# Altium project EIT_Phase1_v1.0.PrjPcb
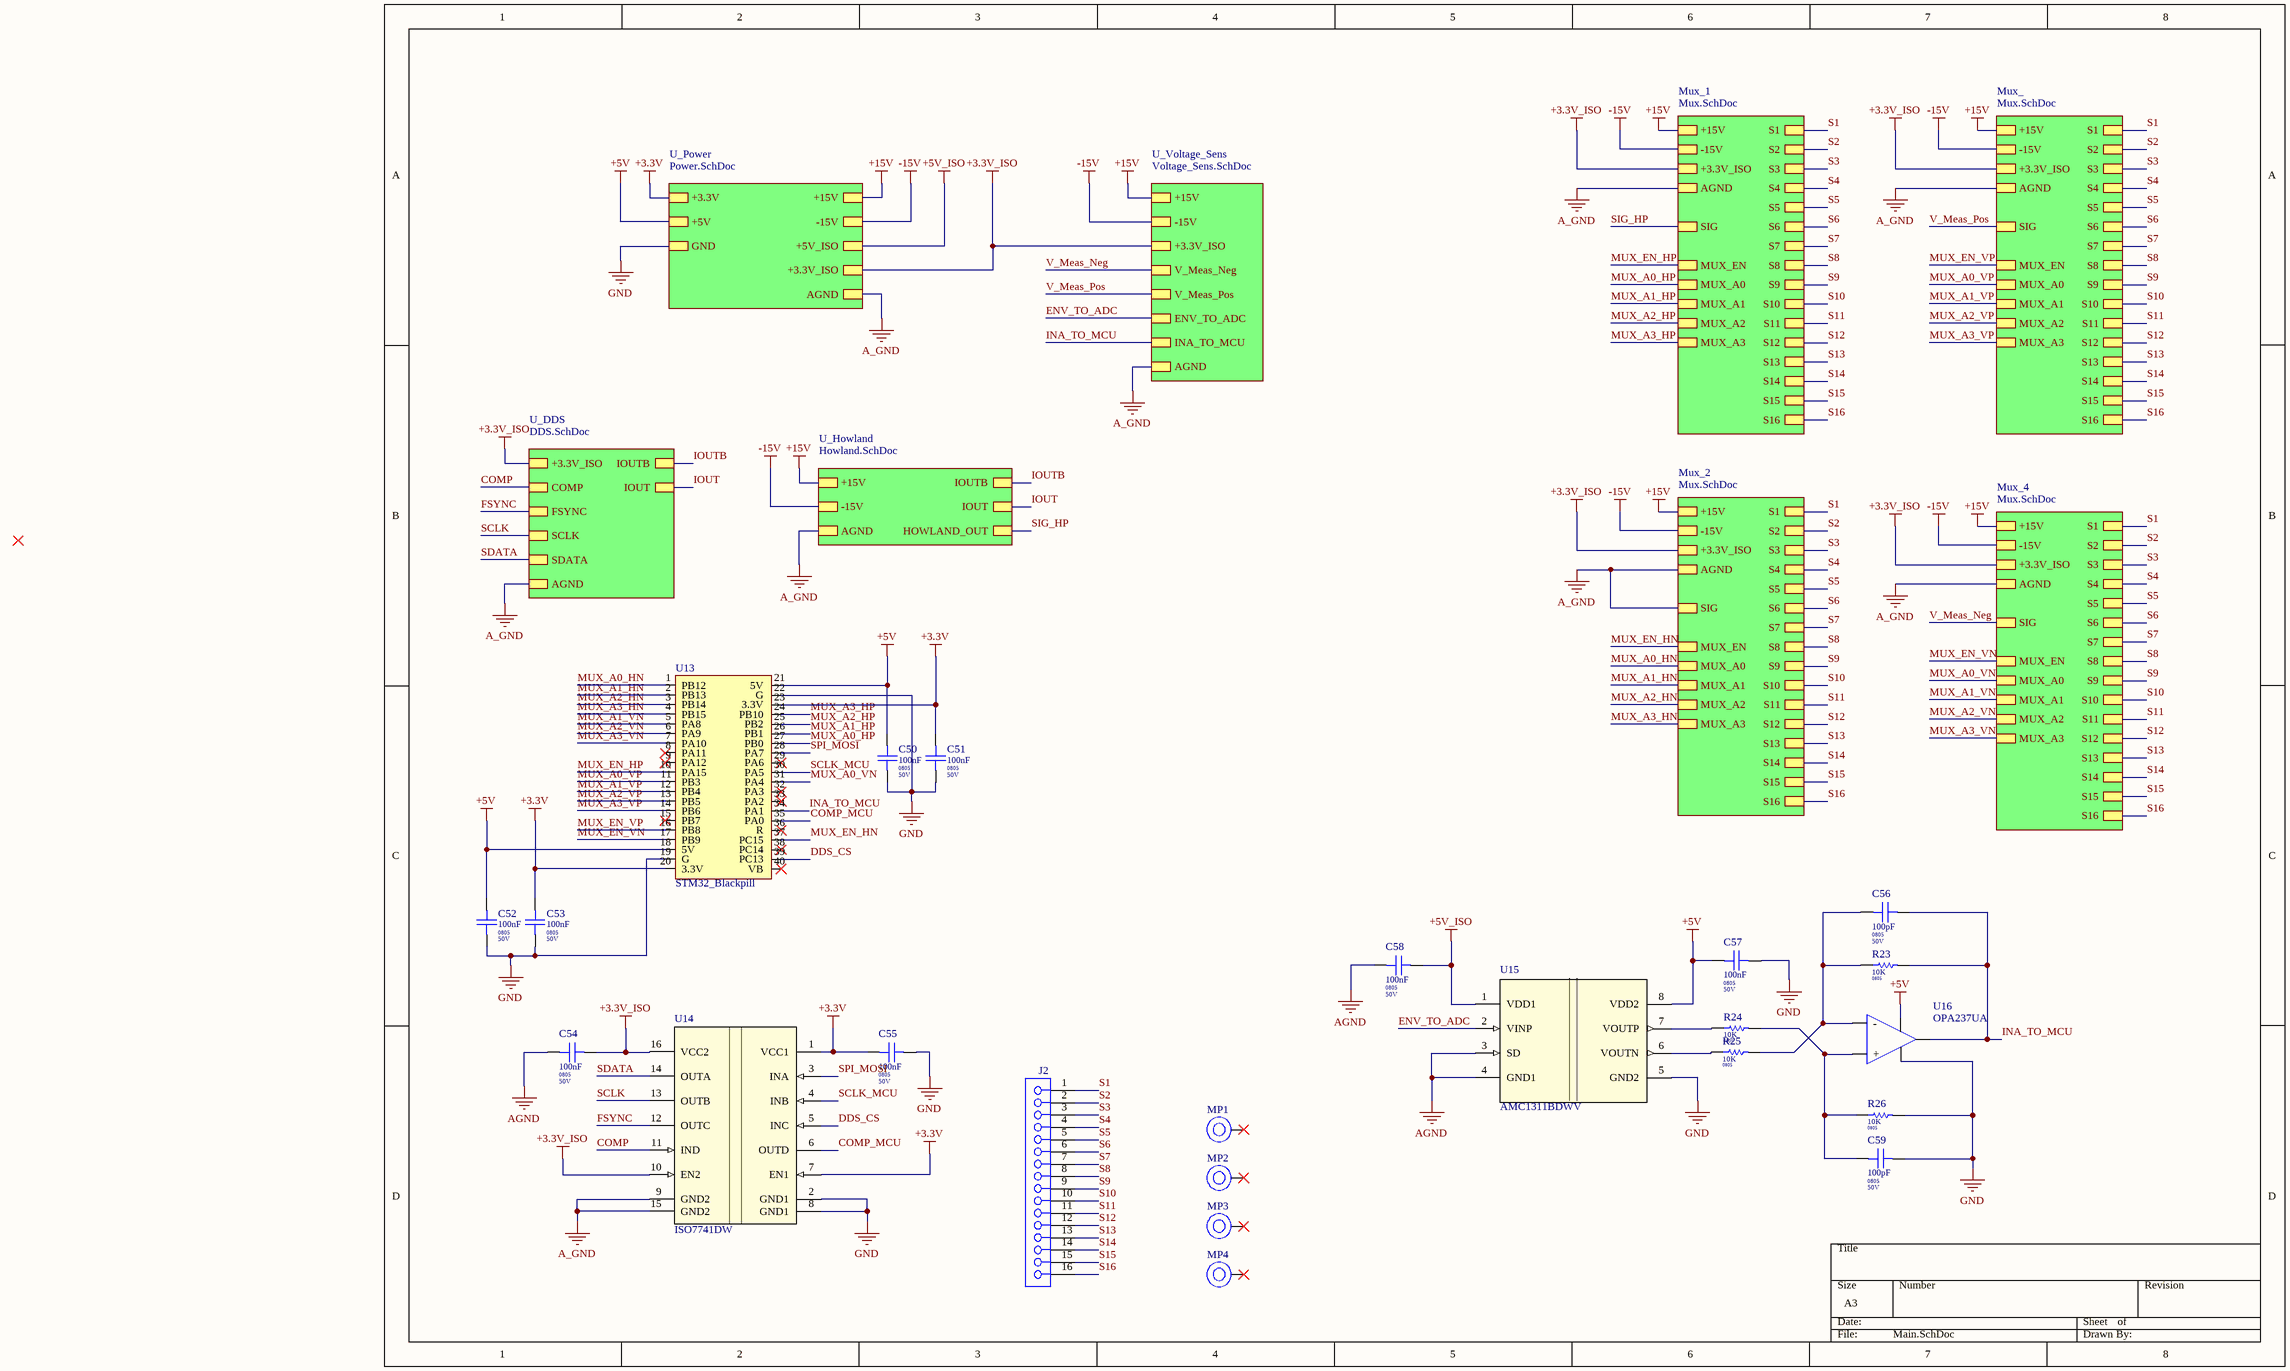
[diagram p0: Main.SchDoc]
6 sheets, 136 parts. Net scope: strictly hierarchical (ports join the sheet entries above them; power ports are local).
Board file: PCB3.PcbDoc
Sheets:
  Main.SchDoc
    U_DDS = DDS.SchDoc
    U_Howland = Howland.SchDoc
    U_Power = Power.SchDoc
    U_Voltage_Sens = Voltage_Sens.SchDoc
    Mux_1 = Mux.SchDoc
    Mux_2 = Mux.SchDoc
    Mux_ = Mux.SchDoc
    Mux_4 = Mux.SchDoc

## Sheet Main.SchDoc
size A3; SheetNumber: 1; SheetTotal: 6

### Parts
C50  Package / Case: 0805  Voltage: 50V  [CAPC 0805]  (hidden comment: 100nF)
C51  Package / Case: 0805  Voltage: 50V  [CAPC 0805]  (hidden comment: 100nF)
C52  Package / Case: 0805  Voltage: 50V  [CAPC 0805]  (hidden comment: 100nF)
C53  Package / Case: 0805  Voltage: 50V  [CAPC 0805]  (hidden comment: 100nF)
C54  Package / Case: 0805  Voltage: 50V  [CAPC 0805]  (hidden comment: 100nF)
C55  Package / Case: 0805  Voltage: 50V  [CAPC 0805]  (hidden comment: 100nF)
C56  Package / Case: 0805  Voltage: 50V  [CAPC 0805]  (hidden comment: 100pF)
C57  Package / Case: 0805  Voltage: 50V  [CAPC 0805]  (hidden comment: 100nF)
C58  Package / Case: 0805  Voltage: 50V  [CAPC 0805]  (hidden comment: 100nF)
C59  Package / Case: 0805  Voltage: 50V  [CAPC 0805]  (hidden comment: 100pF)
J2  61301611821  [61301611821]  (value not drawn)
MP1  M3 x 15mm  [78614150360]  (value not drawn)
MP2  M3 x 15mm  [78614150360]  (value not drawn)
MP3  M3 x 15mm  [78614150360]  (value not drawn)
MP4  M3 x 15mm  [78614150360]  (value not drawn)
R23  Package / Case: 0805  [RESC 0805]  (hidden comment: 10K)
R24  Package / Case: 0805  [RESC 0805]  (hidden comment: 10K)
R25  Package / Case: 0805  [RESC 0805]  (hidden comment: 10K)
R26  Package / Case: 0805  [RESC 0805]  (hidden comment: 10K)
U13  STM32_Blackpill  [STM32_Blackpıll]
U14  ISO7741DW  [DW0016B_M]
U15  AMC1311BDWV  [DWV0008A]
U16  OPA237UA  [SOIC127P599X175-8N]

### Sub-sheets
Mux_ = Mux.SchDoc: +15V, -15V, AGND, +3.3V_ISO, S16, S15, S14, S13, S12, S11, S10, S9, S8, S7, S6, S5, S4, S3, S2, S1, SIG, MUX_EN, MUX_A0, MUX_A1, MUX_A2, MUX_A3
Mux_1 = Mux.SchDoc: +15V, -15V, AGND, +3.3V_ISO, S16, S15, S14, S13, S12, S11, S10, S9, S8, S7, S6, S5, S4, S3, S2, S1, SIG, MUX_EN, MUX_A0, MUX_A1, MUX_A2, MUX_A3
Mux_2 = Mux.SchDoc: +15V, -15V, AGND, +3.3V_ISO, S16, S15, S14, S13, S12, S11, S10, S9, S8, S7, S6, S5, S4, S3, S2, S1, SIG, MUX_EN, MUX_A0, MUX_A1, MUX_A2, MUX_A3
Mux_4 = Mux.SchDoc: +15V, -15V, AGND, +3.3V_ISO, S16, S15, S14, S13, S12, S11, S10, S9, S8, S7, S6, S5, S4, S3, S2, S1, SIG, MUX_EN, MUX_A0, MUX_A1, MUX_A2, MUX_A3
U_DDS = DDS.SchDoc: +3.3V_ISO, AGND, IOUTB, IOUT, COMP, FSYNC, SCLK, SDATA
U_Howland = Howland.SchDoc: +15V, -15V, AGND, IOUTB, IOUT, HOWLAND_OUT
U_Power = Power.SchDoc: +3.3V, +15V, -15V, GND, AGND, +5V, +3.3V_ISO, +5V_ISO
U_Voltage_Sens = Voltage_Sens.SchDoc: +15V, -15V, AGND, +3.3V_ISO, V_Meas_Neg, V_Meas_Pos, ENV_TO_ADC, INA_TO_MCU

### Nets
+3.3V: C51.2 C53.2 C55.2 U13.20(3.3V) U13.23(3.3V) U14.1(VCC1) U14.7(EN1) ; sheet U_Power/+3.3V
+3.3V_ISO: C54.1 U14.10(EN2) U14.16(VCC2) ; sheet U_DDS/+3.3V_ISO, sheet U_Power/+3.3V_ISO, sheet U_Voltage_Sens/+3.3V_ISO, sheet Mux_1/+3.3V_ISO, sheet Mux_2/+3.3V_ISO, sheet Mux_/+3.3V_ISO, sheet Mux_4/+3.3V_ISO
+5V: C50.2 C52.2 C57.2 U13.18(5V) U13.21(5V) U15.8(VDD2) U16.7(V+) ; sheet U_Power/+5V
+5V_ISO: C58.1 U15.1(VDD1) ; sheet U_Power/+5V_ISO
+15V: sheet U_Howland/+15V, sheet U_Power/+15V, sheet U_Voltage_Sens/+15V, sheet Mux_1/+15V, sheet Mux_2/+15V, sheet Mux_/+15V, sheet Mux_4/+15V
-15V: sheet U_Howland/-15V, sheet U_Power/-15V, sheet U_Voltage_Sens/-15V, sheet Mux_1/-15V, sheet Mux_2/-15V, sheet Mux_/-15V, sheet Mux_4/-15V
A_GND: U14.9(GND2) U14.15(GND2) ; sheet U_DDS/AGND, sheet U_Howland/AGND, sheet U_Power/AGND, sheet U_Voltage_Sens/AGND, sheet Mux_1/AGND, sheet Mux_2/AGND, sheet Mux_2/SIG, sheet Mux_/AGND, sheet Mux_4/AGND  [project net SIG]
AGND: C54.2 C58.2 U15.3(SD) U15.4(GND1)
GND: C50.1 C51.1 C52.1 C53.1 C55.1 C57.1 C59.2 R26.1 U13.19(G) U13.22(G) U14.2(GND1) U14.8(GND1) U15.5(GND2) U16.4(V-) ; sheet U_Power/GND
COMP: U14.11(IND) ; sheet U_DDS/COMP
COMP_MCU: U13.35(PA0) U14.6(OUTD)
DDS_CS: U13.39(PC13) U14.5(INC)
ENV_TO_ADC: U15.2(VINP) ; sheet U_Voltage_Sens/ENV_TO_ADC
FSYNC: U14.12(OUTC) ; sheet U_DDS/FSYNC
INA_TO_MCU: C56.2 R23.1 U13.34(PA1) U16.6(Vout) ; sheet U_Voltage_Sens/INA_TO_MCU
IOUT: sheet U_DDS/IOUT, sheet U_Howland/IOUT
IOUTB: sheet U_DDS/IOUTB, sheet U_Howland/IOUTB
MUX_A0_HN: U13.1(PB12) ; sheet Mux_2/MUX_A0
MUX_A0_HP: U13.27(PB0) ; sheet Mux_1/MUX_A0
MUX_A0_VN: U13.31(PA4) ; sheet Mux_4/MUX_A0
MUX_A0_VP: U13.11(PB3) ; sheet Mux_/MUX_A0
MUX_A1_HN: U13.2(PB13) ; sheet Mux_2/MUX_A1
MUX_A1_HP: U13.26(PB1) ; sheet Mux_1/MUX_A1
MUX_A1_VN: U13.5(PA8) ; sheet Mux_4/MUX_A1
MUX_A1_VP: U13.12(PB4) ; sheet Mux_/MUX_A1
MUX_A2_HN: U13.3(PB14) ; sheet Mux_2/MUX_A2
MUX_A2_HP: U13.25(PB2) ; sheet Mux_1/MUX_A2
MUX_A2_VN: U13.6(PA9) ; sheet Mux_4/MUX_A2
MUX_A2_VP: U13.13(PB5) ; sheet Mux_/MUX_A2
MUX_A3_HN: U13.4(PB15) ; sheet Mux_2/MUX_A3
MUX_A3_HP: U13.24(PB10) ; sheet Mux_1/MUX_A3
MUX_A3_VN: U13.7(PA10) ; sheet Mux_4/MUX_A3
MUX_A3_VP: U13.14(PB6) ; sheet Mux_/MUX_A3
MUX_EN_HN: U13.37(PC15) ; sheet Mux_2/MUX_EN
MUX_EN_HP: U13.10(PA15) ; sheet Mux_1/MUX_EN
MUX_EN_VN: U13.17(PB9) ; sheet Mux_4/MUX_EN
MUX_EN_VP: U13.16(PB8) ; sheet Mux_/MUX_EN
S1: J2.1 ; sheet Mux_1/S1, sheet Mux_2/S1, sheet Mux_/S1, sheet Mux_4/S1
S2: J2.2 ; sheet Mux_1/S2, sheet Mux_2/S2, sheet Mux_/S2, sheet Mux_4/S2
S3: J2.3 ; sheet Mux_1/S3, sheet Mux_2/S3, sheet Mux_/S3, sheet Mux_4/S3
S4: J2.4 ; sheet Mux_1/S4, sheet Mux_2/S4, sheet Mux_/S4, sheet Mux_4/S4
S5: J2.5 ; sheet Mux_1/S5, sheet Mux_2/S5, sheet Mux_/S5, sheet Mux_4/S5
S6: J2.6 ; sheet Mux_1/S6, sheet Mux_2/S6, sheet Mux_/S6, sheet Mux_4/S6
S7: J2.7 ; sheet Mux_1/S7, sheet Mux_2/S7, sheet Mux_/S7, sheet Mux_4/S7
S8: J2.8 ; sheet Mux_1/S8, sheet Mux_2/S8, sheet Mux_/S8, sheet Mux_4/S8
S9: J2.9 ; sheet Mux_1/S9, sheet Mux_2/S9, sheet Mux_/S9, sheet Mux_4/S9
S10: J2.10 ; sheet Mux_1/S10, sheet Mux_2/S10, sheet Mux_/S10, sheet Mux_4/S10
S11: J2.11 ; sheet Mux_1/S11, sheet Mux_2/S11, sheet Mux_/S11, sheet Mux_4/S11
S12: J2.12 ; sheet Mux_1/S12, sheet Mux_2/S12, sheet Mux_/S12, sheet Mux_4/S12
S13: J2.13 ; sheet Mux_1/S13, sheet Mux_2/S13, sheet Mux_/S13, sheet Mux_4/S13
S14: J2.14 ; sheet Mux_1/S14, sheet Mux_2/S14, sheet Mux_/S14, sheet Mux_4/S14
S15: J2.15 ; sheet Mux_1/S15, sheet Mux_2/S15, sheet Mux_/S15, sheet Mux_4/S15
S16: J2.16 ; sheet Mux_1/S16, sheet Mux_2/S16, sheet Mux_/S16, sheet Mux_4/S16
SCLK: U14.13(OUTB) ; sheet U_DDS/SCLK
SCLK_MCU: U13.30(PA5) U14.4(INB)
SDATA: U14.14(OUTA) ; sheet U_DDS/SDATA
SIG_HP: sheet U_Howland/HOWLAND_OUT, sheet Mux_1/SIG
SPI_MOSI: U13.28(PA7) U14.3(INA)
V_Meas_Neg: sheet U_Voltage_Sens/V_Meas_Neg, sheet Mux_4/SIG
V_Meas_Pos: sheet U_Voltage_Sens/V_Meas_Pos, sheet Mux_/SIG
NetC56_1: C56.1 R23.2 R25.1 U16.2(-)
NetC59_1: C59.1 R24.1 R26.2 U16.3(+)
NetR24_2: R24.2 U15.7(VOUTP)
NetR25_2: R25.2 U15.6(VOUTN)

Not connected (* = marked no-connect by the designer): MP1 1*; MP2 1*; MP3 1*; MP4 1*; U13 8(PA11)* 9(PA12)* 15(PB7)* 29(PA6)* 32(PA3)* 33(PA2)* 36(R)* 38(PC14)* 40(VB)*

### Library data of the parts
C50-C55 C57 C58 = CAPC0572: Capacitor Ceramic 100nF 50V 0805; Tolerance: %10; Value Rating: nF; Favorites: Favorite; Value: 100nF; Part Number: CAPC0572; Category: Capacitor Ceramic; Values: 100nF 50V
C56 C59 = CAPC0548: Capacitor Ceramic 100pF 50V 0805; Tolerance: %10; Value Rating: pF; Value: 100pF; Part Number: CAPC0548; Category: Capacitor Ceramic; Values: 100pF 50V
J2 = 61301611821: WR-PHD Socket Header, THT, Vertical, pitch 2.54mm, 1 Row, 16P; Manufacturer: Wurth Elektronik; Contact Resistance: 20mOhm; Rated Current: 3A; Working Voltage: 250V; Withstanding Voltage: 500V; Manufacturer Part Number: 61301611821; Category: Board-to-Board Connectors; Match Code: WR-PHD; ComponentLink1Description: Website Link; ComponentLink1URL: https://www.we-online.com/redexpert/article/61301611821?ad; ComponentLink2Description: Datasheet Link; ComponentLink2URL: https://www.we-online.com/redexpert/spec/61301611821?ad; Mount: Through Hole; Min Operating Temperature: -40°C; Max Operating Temperature: 105°C; Packaging: Tray; Gender: Socket Header; Number of Pins: 16; Number of Rows: 1; Orientation: Vertical; Lead Pitch: 2.54mm
MP1-MP4 = 78614150360: WA-SMSA SMT Spacer Studs Automotive, OD 6mm, ID 4.2mm, M3 x 15mm; Manufacturer: Wurth Elektronik; Surface: Tin; Solder Cream Thickness Min: 150um; Tightenning Torque Max: 0.5N*m; Manufacturer Part Number: 78614150360; Category: SMT Spacers; Match Code: WA-SMSA; ComponentLink1Description: Website Link; ComponentLink1URL: https://www.we-online.com/redexpert/article/78614150360?ad; ComponentLink2Description: Datasheet Link; ComponentLink2URL: https://www.we-online.com/redexpert/spec/78614150360?ad; Mount: Surface Mount; Min Operating Temperature: -55°C; Max Operating Temperature: 150°C; Packaging: Tape and Reel; Height: 15mm; Automotive: Yes; Inside Diameter: 4.2mm; Material: Steel; Outside Diameter: 6mm; Thread Size: M3
R23-R26 = R0366: 10K 0805; Part Number: R0366; Tolerance: %5; Power: 1/10W; Value: 10K; Category: Resistor; Values: 10K
U14 = ISO7741DW: Robust EMC, quad-channel, 3/1, reinforced digital isolator 16-SOIC -55 to 125; Manufacturer_Name: Texas Instruments; TYPE: TYPE; RefDes: RefDes; Copyright: Copyright (C) 2026 Ultra Librarian. All rights reserved.; Manufacturer_Part_Number: ISO7741DW
U15 = AMC1311BDWV: 2-V input, precision voltage sensing reinforced isolated amplifier 8-SOIC -55 to 125; Manufacturer_Name: Texas Instruments; TYPE: TYPE; RefDes: RefDes; Copyright: Copyright (C) 2025 Ultra Librarian. All rights reserved.; Manufacturer_Part_Number: AMC1311BDWV
U16 = OPA237UA: Single-Supply Operational Amplifiers MicroAmplifier™ Series 8-SOIC -40 to 70; Manufacturer: Texas Instruments; Bandwidth: 1.5MHz; Unity Gain Bandwidth Product: 1.4MHz; Min Supply Voltage: 2.7V; Max Supply Voltage: 36V; Nominal Supply Current: 475uA; Voltage Gain: 88dB; Common Mode Rejection Ratio: 78dB; Number of Channels: 1; Slew Rate: 0.5V/µs; Max I/O Voltage: 750uV; Input Bias Current: 40nA; Operating Supply Current: 200uA; Power Supply Rejection Ratio (PSRR): 100dB; Output Current per Channel: 8mA; Operating Supply Voltage: 5V; Dual Supply Voltage: 15V; Min Dual Supply Voltage: 1.35V; Max Dual Supply Voltage: 18V; Supplier 1: Digi-Key; Manufacturer Part Number: OPA237UA; RoHS: Yes; Category: Amplifiers - Op Amps, Buffer, Instrumentation; Stock 1: 186; Pricing 1: 1=2,06000, 10=1,85400, 25=1,74880, 100=1,49010, 250=1,39920, 500=1,22430, 1000=1,15500 (USD); Case/Package: D; Number of Pins: 8; Min Operating Temperature: -40°C; Max Operating Temperature: 70°C; Package Quantity: 75; Packaging: Rail/Tube; Number of Circuits: 1; Gain Bandwidth Product: 1.4MHz; Input Offset Voltage (Vos): 750uV; Number of Elements: 1; Number of Amplifiers: 1; Nominal Gain Bandwidth Product: 1.4MHz; Length: 4.9mm; Width: 3.91mm; Height: 1.58mm; Radiation Hardening: No; Lead Free: Lead Free; REACH SVHC: No SVHC; ComponentLink1URL: https://datasheet.ciiva.com/7684/1789011-7684483.pdf?src-supplier=Element14; ComponentLink1Description: https://datasheet.ciiva.com/7684/1789011-7684483.pdf?src-supplier=Element14; ComponentLink2URL: https://datasheet.ciiva.com/22729/1716473-22729883.pdf?src-supplier=Element14; ComponentLink2Description: https://datasheet.ciiva.com/22729/1716473-22729883.pdf?src-supplier=Element14; ComponentLink3URL: https://datasheet.ciiva.com/2973/sbos057a-2973962.pdf?src-supplier=Avnet; ComponentLink3Description: https://datasheet.ciiva.com/2973/sbos057a-2973962.pdf?src-supplier=Avnet; ComponentLink4URL: https://datasheet.ciiva.com/26243/sbos057a-26243614.pdf?src-supplier=Avnet+Europe; ComponentLink4Description: https://datasheet.ciiva.com/26243/sbos057a-26243614.pdf?src-supplier=Avnet+Europe; ComponentLink5URL: https://datasheet.ciiva.com/1803/opa2237-1803652.pdf?src-supplier=Digi-Key; ComponentLink5Description: https://datasheet.ciiva.com/1803/opa2237-1803652.pdf?src-supplier=Digi-Key; ComponentLink6URL: https://datasheet.ciiva.com/48707/001011214-da-01-en-ic-opamp-gp-1-5mhz-s-opa237ua-soic-8-tid-48707210.pdf?src-supplier=Conrad; ComponentLink6Description: https://datasheet.ciiva.com/48707/001011214-da-01-en-ic-opamp-gp-1-5mhz-s-opa237ua-soic-8-tid-48707210.pdf?src-supplier=Conrad; Supplier Part Number 1: OPA237UA-ND

## Sheet DDS.SchDoc
size A4; SheetNumber: 5; SheetTotal: 6
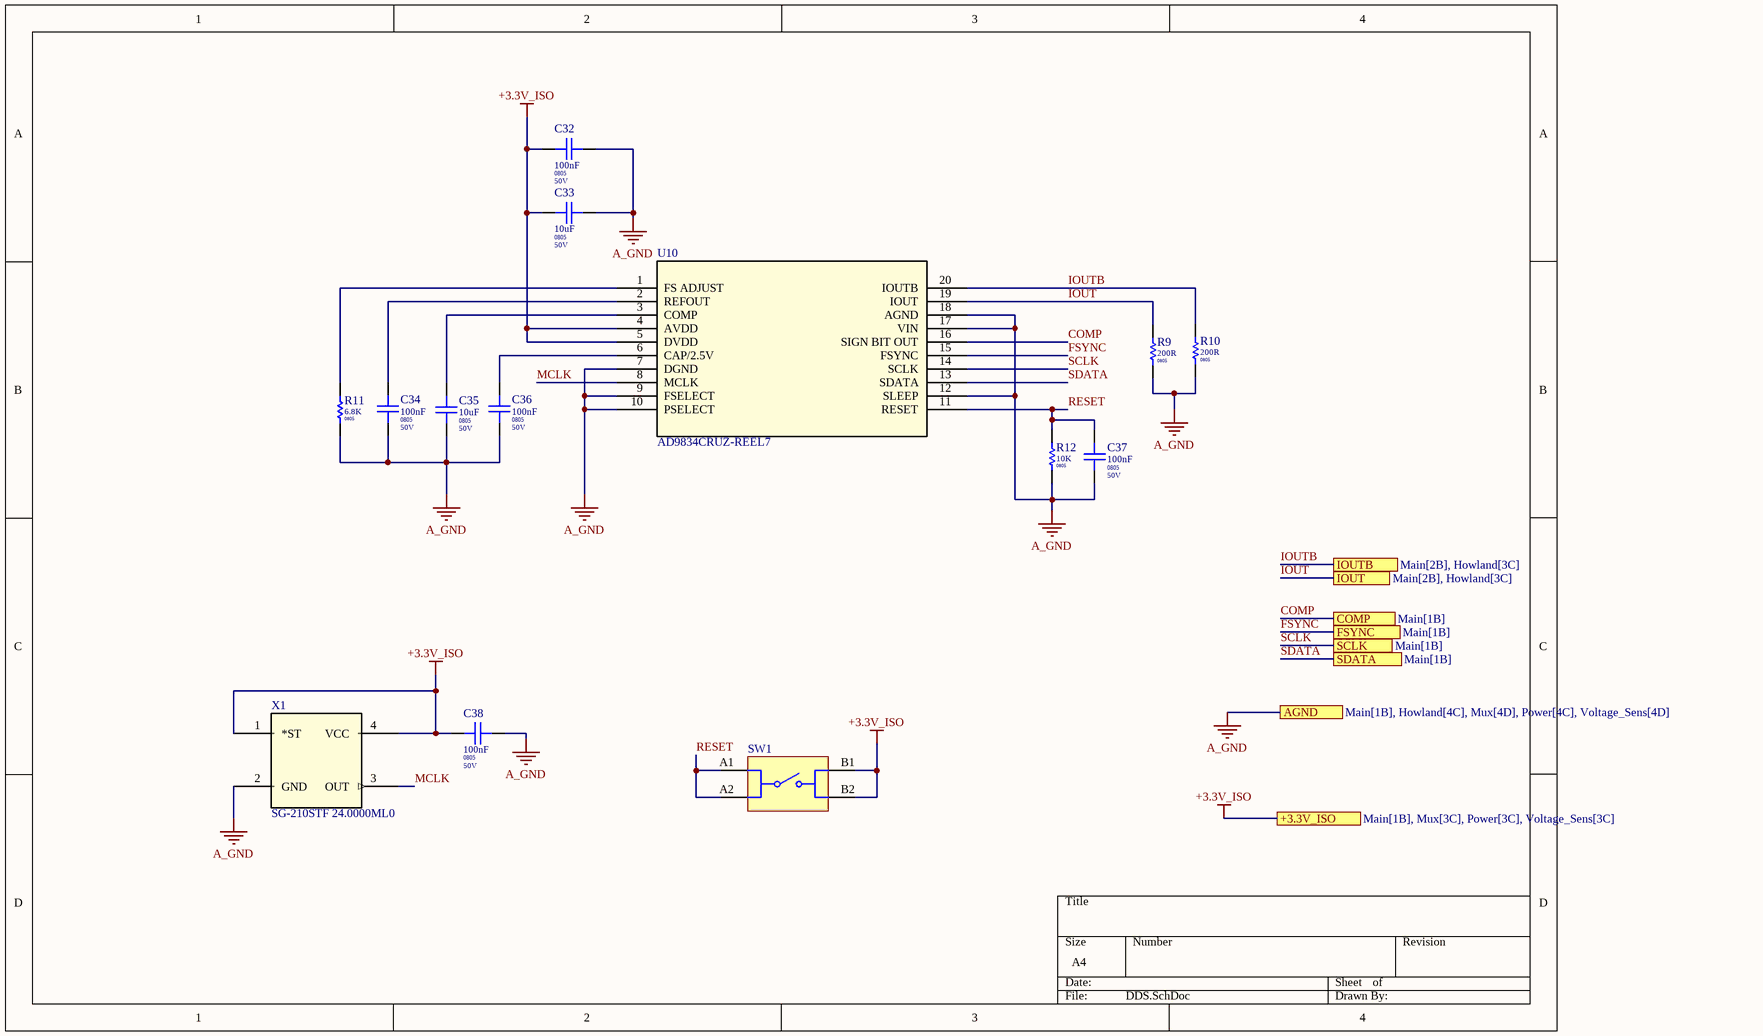
[diagram p1: DDS.SchDoc]

### Parts
C32  Package / Case: 0805  Voltage: 50V  [CAPC 0805]  (hidden comment: 100nF)
C33  Package / Case: 0805  Voltage: 50V  [CAPC 0805]  (hidden comment: 10uF)
C34  Package / Case: 0805  Voltage: 50V  [CAPC 0805]  (hidden comment: 100nF)
C35  Package / Case: 0805  Voltage: 50V  [CAPC 0805]  (hidden comment: 10uF)
C36  Package / Case: 0805  Voltage: 50V  [CAPC 0805]  (hidden comment: 100nF)
C37  Package / Case: 0805  Voltage: 50V  [CAPC 0805]  (hidden comment: 100nF)
C38  Package / Case: 0805  Voltage: 50V  [CAPC 0805]  (hidden comment: 100nF)
R9  Package / Case: 0805  [RESC 0805]  (hidden comment: 200R)
R10  Package / Case: 0805  [RESC 0805]  (hidden comment: 200R)
R11  Package / Case: 0805  [RESC 0805]  (hidden comment: 6.8K)
R12  Package / Case: 0805  [RESC 0805]  (hidden comment: 10K)
SW1  430451025836  [430451025836]  (value not drawn)
U10  AD9834CRUZ-REEL7  [RU_20_ADI-M]
X1  SG-210STF 24.0000ML0  [SG-210STF_EPS]

### Ports
+3.3V_ISO (see Main[1B], Mux[3C], Power[3C], Voltage_Sens[3C]), AGND (see Main[1B], Howland[4C], Mux[4D], Power[4C], Voltage_Sens[4D]), COMP (see Main[1B]), FSYNC (see Main[1B]), IOUT (see Main[2B], Howland[3C]), IOUTB (see Main[2B], Howland[3C]), SCLK (see Main[1B]), SDATA (see Main[1B])

### Nets
+3.3V_ISO: C32.2 C33.2 C38.2 SW1.B1 SW1.B2 U10.4(AVDD) U10.5(DVDD) X1.1(*ST) X1.4(VCC) ; port +3.3V_ISO
A_GND: C32.1 C33.1 C34.2 C35.2 C36.2 C37.2 C38.1 R9.1 R10.1 R11.1 R12.1 U10.7(DGND) U10.9(FSELECT) U10.10(PSELECT) U10.12(SLEEP) U10.17(VIN) U10.18(AGND) X1.2(GND) ; port AGND  [project net SIG]
COMP: U10.16(SIGN_BIT_OUT) ; port COMP
FSYNC: U10.15(FSYNC) ; port FSYNC
IOUT: R9.2 U10.19(IOUT) ; port IOUT
IOUTB: R10.2 U10.20(IOUTB) ; port IOUTB
MCLK: U10.8(MCLK) X1.3(OUT)
RESET: C37.1 R12.2 SW1.A1 SW1.A2 U10.11(RESET)
SCLK: U10.14(SCLK) ; port SCLK
SDATA: U10.13(SDATA) ; port SDATA
NetC34_1: C34.1 U10.2(REFOUT)
NetC35_1: C35.1 U10.3(COMP)
NetC36_1: C36.1 U10.6(CAP/2.5V)
NetR11_2: R11.2 U10.1(FS_ADJUST)

### Library data of the parts
C32 C34 C36-C38 = CAPC0572: as C50 on sheet Main; Value: 100nF; Part Number: CAPC0572; Category: Capacitor Ceramic; Values: 100nF 50V
C33 C35 = CAPC0588: Capacitor Ceramic 10uF 50V 0805; Tolerance: %10; Value Rating: uF; Value: 10uF; Part Number: CAPC0588; Category: Capacitor Ceramic; Values: 10uF 50V
R9 R10 = R0325: 200R 0805; Part Number: R0325; Tolerance: %5; Power: 1/10W; Value: 200R; Category: Resistor; Values: 200R
R11 = R0362: 6.8K 0805; Part Number: R0362; Tolerance: %5; Power: 1/10W; Value: 6.8K; Category: Resistor; Values: 6.8K
R12 = R0366: as R23 on sheet Main; Value: 10K; Category: Resistor; Values: 10K
SW1 = 430451025836: WS-TASV SMT Washable Tact Switch, 6mm x 6mm x 2.5mm, SPST-NO, 360gf, 12V, 50mA; Manufacturer: Wurth Elektronik; Washable: Yes; Manufacturer Part Number: 430451025836; Category: Tact Switch; Match Code: WS-TASV; ComponentLink1Description: Website Link; ComponentLink1URL: https://www.we-online.com/redexpert/article/430451025836?ad; ComponentLink2Description: Datasheet Link; ComponentLink2URL: https://www.we-online.com/redexpert/spec/430451025836?ad; Mount: Surface Mount; Min Operating Temperature: -40°C; Max Operating Temperature: 85°C; Packaging: Tape and Reel; Length: 6mm; Width: 6mm; Height: 2.5mm; Circuit: SPST-NO; Contact Material: Stainless Steel; Contact Plating: Silver; Operation Force: 360gf; Rated Current: 50mA; Rated Voltage (DC): 12V; Terminal Material: Brass; Terminal Plating: Silver
U10 = AD9834CRUZ-REEL7: 20 mW Power, 2.3 V to 5.5 V, 75 MHz Complete DDS; Manufacturer_Name: Analog Devices Inc; Copyright: Copyright (C) 2026 Ultra Librarian. All rights reserved.; Manufacturer_Part_Number: AD9834CRUZ-REEL7; RefDes: RefDes; Type: Type
X1 = SG-210STF 24.0000ML0: Description; Manufacturer_Name: Epson; Type: Oscillators; Copyright: Copyright (C) 2025 Ultra Librarian. All rights reserved.; Manufacturer_Part_Number: SG-210STF 24.0000ML0; RefDes: RefDes

## Sheet Howland.SchDoc
size A4; SheetNumber: 6; SheetTotal: 6
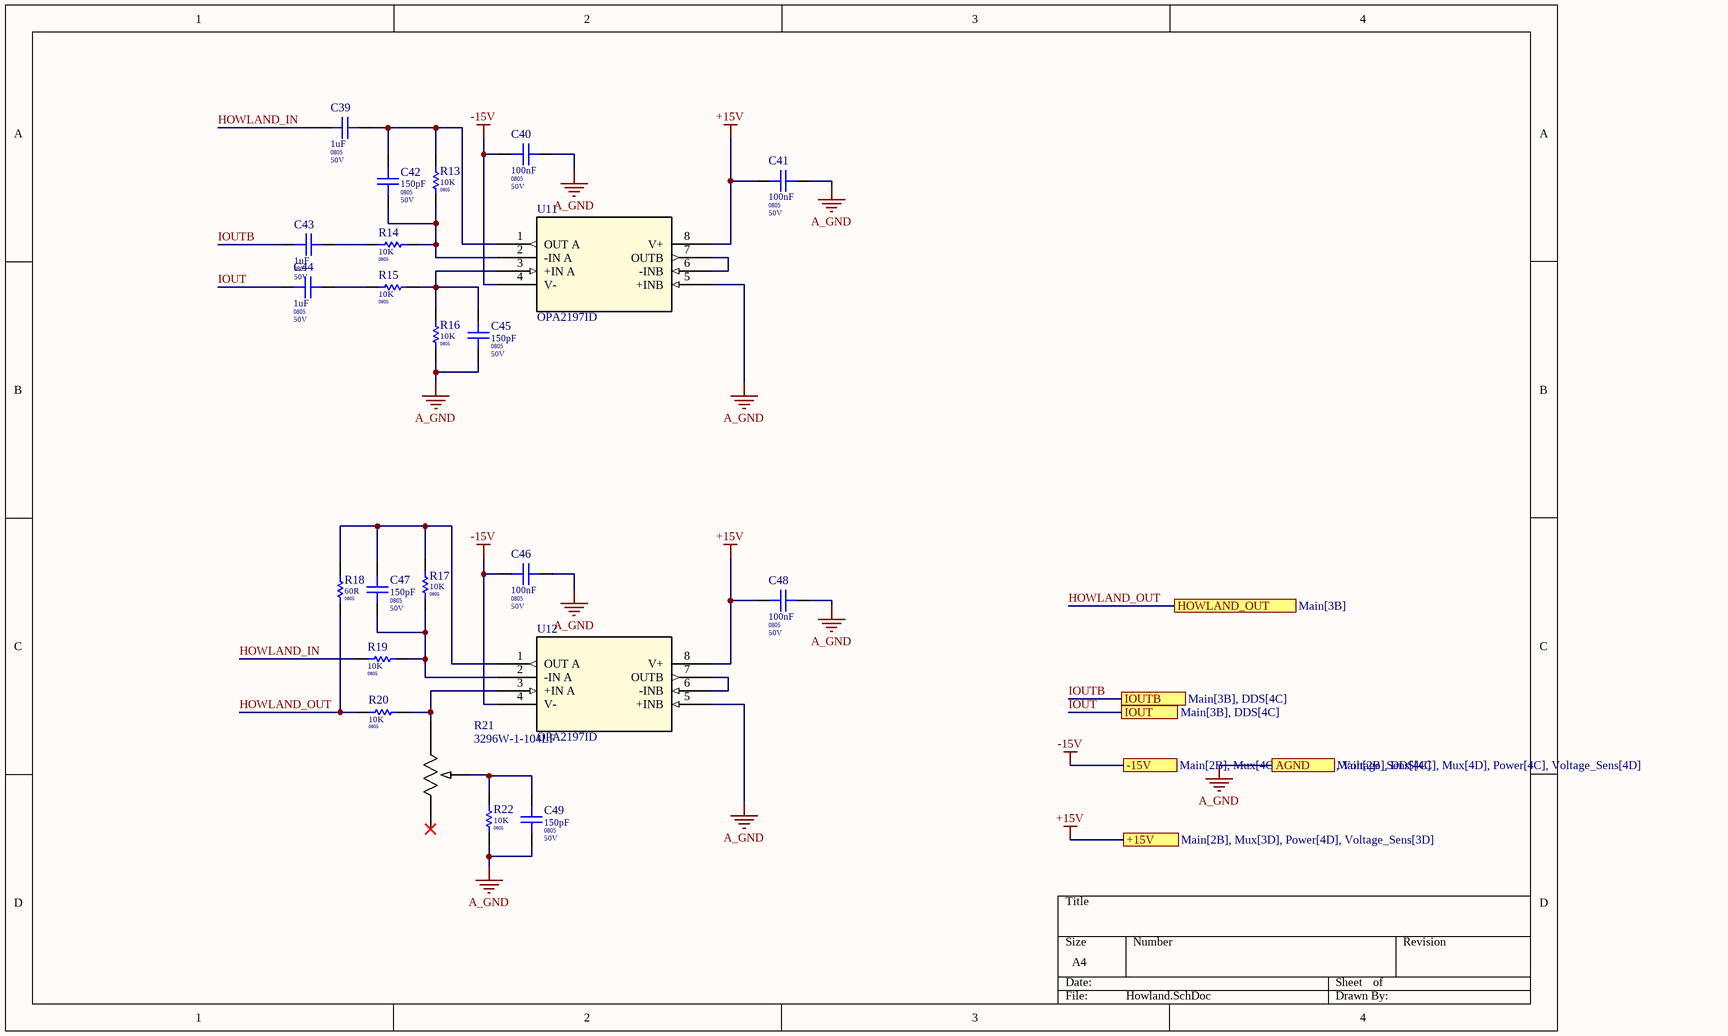
[diagram p2: Howland.SchDoc]

### Parts
C39  Package / Case: 0805  Voltage: 50V  [CAPC 0805]  (hidden comment: 1uF)
C40  Package / Case: 0805  Voltage: 50V  [CAPC 0805]  (hidden comment: 100nF)
C41  Package / Case: 0805  Voltage: 50V  [CAPC 0805]  (hidden comment: 100nF)
C42  Package / Case: 0805  Voltage: 50V  [CAPC 0805]  (hidden comment: 150pF)
C43  Package / Case: 0805  Voltage: 50V  [CAPC 0805]  (hidden comment: 1uF)
C44  Package / Case: 0805  Voltage: 50V  [CAPC 0805]  (hidden comment: 1uF)
C45  Package / Case: 0805  Voltage: 50V  [CAPC 0805]  (hidden comment: 150pF)
C46  Package / Case: 0805  Voltage: 50V  [CAPC 0805]  (hidden comment: 100nF)
C47  Package / Case: 0805  Voltage: 50V  [CAPC 0805]  (hidden comment: 150pF)
C48  Package / Case: 0805  Voltage: 50V  [CAPC 0805]  (hidden comment: 100nF)
C49  Package / Case: 0805  Voltage: 50V  [CAPC 0805]  (hidden comment: 150pF)
R13  Package / Case: 0805  [RESC 0805]  (hidden comment: 10K)
R14  Package / Case: 0805  [RESC 0805]  (hidden comment: 10K)
R15  Package / Case: 0805  [RESC 0805]  (hidden comment: 10K)
R16  Package / Case: 0805  [RESC 0805]  (hidden comment: 10K)
R17  Package / Case: 0805  [RESC 0805]  (hidden comment: 10K)
R18  Package / Case: 0805  [RESC 0805]  (hidden comment: 60R)
R19  Package / Case: 0805  [RESC 0805]  (hidden comment: 10K)
R20  Package / Case: 0805  [RESC 0805]  (hidden comment: 10K)
R21  3296W-1-104LF  [POT_3296W]
R22  Package / Case: 0805  [RESC 0805]  (hidden comment: 10K)
U11  OPA2197ID  [D8_TEX-M]
U12  OPA2197ID  [D8_TEX-M]

### Ports
+15V (see Main[2B], Mux[3D], Power[4D], Voltage_Sens[3D]), -15V (see Main[2B], Mux[4C], Power[4C], Voltage_Sens[4C]), AGND (see Main[2B], DDS[4C], Mux[4D], Power[4C], Voltage_Sens[4D]), HOWLAND_OUT (see Main[3B]), IOUT (see Main[3B], DDS[4C]), IOUTB (see Main[3B], DDS[4C])

### Nets
+15V: C41.2 C48.2 U11.8(V+) U12.8(V+) ; port +15V
-15V: C40.2 C46.2 U11.4(V-) U12.4(V-) ; port -15V
A_GND: C40.1 C41.1 C45.1 C46.1 C48.1 C49.1 R16.2 R22.2 U11.5(+INB) U12.5(+INB) ; port AGND  [project net SIG]
HOWLAND_IN: C39.1 R19.1
HOWLAND_OUT: R18.1 R20.1 ; port HOWLAND_OUT  [project net SIG_HP]
IOUT: C44.1 ; port IOUT
IOUTB: C43.1 ; port IOUTB
NetC39_2: C39.2 C42.2 R13.1 U11.1(OUT_A)
NetC42_1: C42.1 R13.2 R14.1 U11.2(-IN_A)
NetC43_2: C43.2 R14.2
NetC44_2: C44.2 R15.2
NetC45_2: C45.2 R15.1 R16.1 U11.3(+IN_A)
NetC47_1: C47.1 R17.2 R19.2 U12.2(-IN_A)
NetC47_2: C47.2 R17.1 R18.2 U12.1(OUT_A)
NetC49_2: C49.2 R21.2 R22.1
NetR20_2: R20.2 R21.1 U12.3(+IN_A)
NetU11_6: U11.6(-INB) U11.7(OUTB)
NetU12_6: U12.6(-INB) U12.7(OUTB)

Not connected (* = marked no-connect by the designer): R21 3*

### Library data of the parts
C39 C43 C44 = CAPC0580: Capacitor Ceramic 1uF 50V 0805; Tolerance: %10; Value Rating: uF; Values: 1uF 50V; Favorites: Favorite; Value: 1uF; Part Number: CAPC0580; Category: Capacitor Ceramic
C40 C41 C46 C48 = CAPC0572: as C50 on sheet Main; Value: 100nF; Part Number: CAPC0572; Category: Capacitor Ceramic; Values: 100nF 50V
C42 C45 C47 C49 = CAPC0549: Capacitor Ceramic 150pF 50V 0805; Tolerance: %10; Value Rating: pF; Value: 150pF; Part Number: CAPC0549; Category: Capacitor Ceramic; Values: 150pF 50V
R13-R17 R19 R20 R22 = R0366: as R23 on sheet Main; Value: 10K; Category: Resistor; Values: 10K
R18 = R0323: 160R 0805; Part Number: R0323; Tolerance: %5; Power: 1/10W; Value: 60R; Category: Resistor; Values: 160R
R21 = 3296W-1-104LF: Description; Manufacturer_Name: Bourns Electronics; Copyright: Copyright (C) 2025 Ultra Librarian. All rights reserved.; Manufacturer_Part_Number: 3296W-1-104LF
U11 U12 = OPA2197ID: Dual 36-V, precision, rail-to-rail input output, low offset voltage op amp 8-SOIC -40 to 125; Manufacturer_Name: Texas Instruments; Copyright: Copyright (C) 2025 Ultra Librarian. All rights reserved.; Manufacturer_Part_Number: OPA2197ID; RefDes: RefDes; Type: Type

## Sheet Power.SchDoc
size A4; SheetNumber: 2; SheetTotal: 6; SPICEModelCacheCWKBOKIO: <root> / <DocumentId>CWKBOKIO</DocumentId> / <CacheFrame Number="0"> / <Model Name="860020572003_10uf" Kind="CKT"> / <Text>******* / .subckt 860020572003_10uF 1 2 / Rser 1 3 2.05181792146 / Lser 2 4 3.250120717E-09 / C1 3 4 0.00001 / Rpar 3 4 10000000 / .ends 860020572003_10uF</Text> / </Model> / <Model Name="3816_744031100_10u" Kind="CKT"> / <Text>******* / .subckt 3816_744031100_10u 1 2 / Rp 1 2 10770 / Cp 1 2 1.28p / Rs 1 N3 0.185 / L1 N3 2 10u / .ends 3816_744031100_10u</Text> / </Model> / </CacheFrame> / </root>
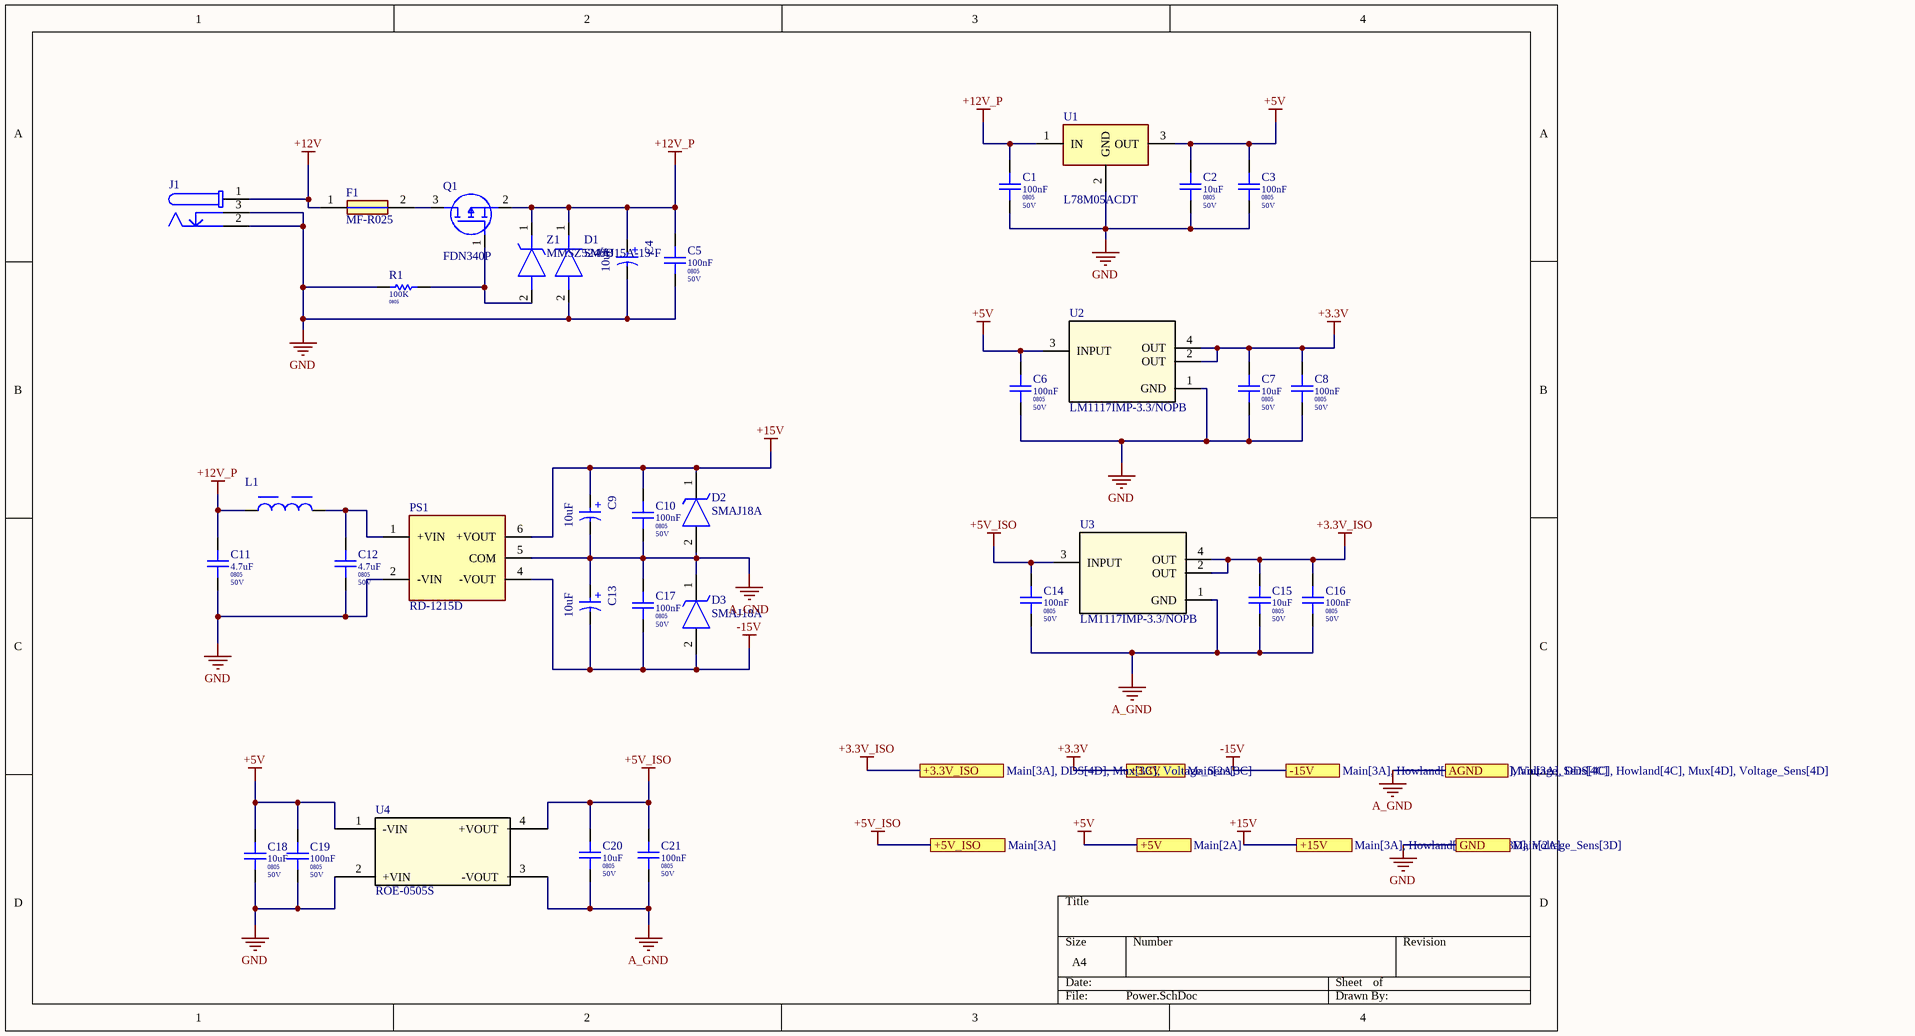
[diagram p3: Power.SchDoc]

### Parts
C1  Package / Case: 0805  Voltage: 50V  [CAPC 0805]  (hidden comment: 100nF)
C2  Package / Case: 0805  Voltage: 50V  [CAPC 0805]  (hidden comment: 10uF)
C3  Package / Case: 0805  Voltage: 50V  [CAPC 0805]  (hidden comment: 100nF)
C4  10uF  [WCAP-ATG5_D5H11]
C5  Package / Case: 0805  Voltage: 50V  [CAPC 0805]  (hidden comment: 100nF)
C6  Package / Case: 0805  Voltage: 50V  [CAPC 0805]  (hidden comment: 100nF)
C7  Package / Case: 0805  Voltage: 50V  [CAPC 0805]  (hidden comment: 10uF)
C8  Package / Case: 0805  Voltage: 50V  [CAPC 0805]  (hidden comment: 100nF)
C9  10uF  [WCAP-ATG5_D5H11]
C10  Package / Case: 0805  Voltage: 50V  [CAPC 0805]  (hidden comment: 100nF)
C11  Package / Case: 0805  Voltage: 50V  [CAPC 0805]  (hidden comment: 4.7uF)
C12  Package / Case: 0805  Voltage: 50V  [CAPC 0805]  (hidden comment: 4.7uF)
C13  10uF  [WCAP-ATG5_D5H11]
C14  Package / Case: 0805  Voltage: 50V  [CAPC 0805]  (hidden comment: 100nF)
C15  Package / Case: 0805  Voltage: 50V  [CAPC 0805]  (hidden comment: 10uF)
C16  Package / Case: 0805  Voltage: 50V  [CAPC 0805]  (hidden comment: 100nF)
C17  Package / Case: 0805  Voltage: 50V  [CAPC 0805]  (hidden comment: 100nF)
C18  Package / Case: 0805  Voltage: 50V  [CAPC 0805]  (hidden comment: 10uF)
C19  Package / Case: 0805  Voltage: 50V  [CAPC 0805]  (hidden comment: 100nF)
C20  Package / Case: 0805  Voltage: 50V  [CAPC 0805]  (hidden comment: 10uF)
C21  Package / Case: 0805  Voltage: 50V  [CAPC 0805]  (hidden comment: 100nF)
D1  SMAJ15A-13-F  [DIOM5226X240N]
D2  SMAJ18A  [DIOM5026X229N]
D3  SMAJ18A  [DIOM5026X229N]
F1  MF-R025  [MFR025]
J1  694106301002  [694106301002]  (value not drawn)
L1  10uH, 0.74A  [WE-TPC_3816]  (value not drawn)
PS1  RD-1215D  [RD1215D]
Q1  FDN340P  [SOT95P237X112-3N]
R1  Package / Case: 0805  [RESC 0805]  (hidden comment: 100K)
U1  L78M05ACDT  [L78M05ACDT]
U2  LM1117IMP-3.3/NOPB  [DCY0004A_M]
U3  LM1117IMP-3.3/NOPB  [DCY0004A_M]
U4  ROE-0505S  [ROE_RCP]
Z1  MMSZ5240B  [SOD3816X128N]

### Ports
+3.3V (see Main[2A]), +3.3V_ISO (see Main[3A], DDS[4D], Mux[3C], Voltage_Sens[3C]), +5V (see Main[2A]), +5V_ISO (see Main[3A]), +15V (see Main[3A], Howland[3D], Mux[3D], Voltage_Sens[3D]), -15V (see Main[3A], Howland[3C], Mux[4C], Voltage_Sens[4C]), AGND (see Main[3A], DDS[4C], Howland[4C], Mux[4D], Voltage_Sens[4D]), GND (see Main[2A])

### Nets
+3.3V: C7.2 C8.2 U2.2(OUT) U2.4(OUT) ; port +3.3V
+3.3V_ISO: C15.2 C16.2 U3.2(OUT) U3.4(OUT) ; port +3.3V_ISO
+5V: C2.2 C3.2 C6.2 C18.2 C19.2 U1.3(OUT) U2.3(INPUT) U4.1(-VIN) ; port +5V
+5V_ISO: C14.2 C20.2 C21.2 U3.3(INPUT) U4.4(+VOUT) ; port +5V_ISO
+12V: F1.1 J1.1
+12V_P: C1.2 C4.1(P) C5.2 C11.2 D1.1(K) L1.1 Q1.2(S) U1.1(IN) Z1.1(K)
+15V: C9.1(P) C10.2 D2.1(K) PS1.6(+VOUT) ; port +15V
-15V: C13.2(N) C17.1 D3.2(A) PS1.4(-VOUT) ; port -15V
A_GND: C9.2(N) C10.1 C13.1(P) C14.1 C15.1 C16.1 C17.2 C20.1 C21.1 D2.2(A) D3.1(K) PS1.5(COM) U3.1(GND) U4.3(-VOUT) ; port AGND  [project net SIG]
GND: C1.1 C2.1 C3.1 C4.2(N) C5.1 C6.1 C7.1 C8.1 C11.1 C12.1 C18.1 C19.1 D1.2(A) J1.2 J1.3 PS1.2(-VIN) R1.2 U1.2(GND) U2.1(GND) U4.2(+VIN) ; port GND
NetC12_2: C12.2 L1.2 PS1.1(+VIN)
NetF1_2: F1.2 Q1.3(D)
NetQ1_1: Q1.1(G) R1.1 Z1.2(A)

### Notes on the sheet
- (in symbol 860020572003) +

### Library data of the parts
C1 C3 C5 C6 C8 C10 C14 C16 C17 C19 C21 = CAPC0572: as C50 on sheet Main; Value: 100nF; Part Number: CAPC0572; Category: Capacitor Ceramic; Values: 100nF 50V
C2 C7 C15 C18 C20 = CAPC0588: as C33 on sheet DDS; Value: 10uF; Part Number: CAPC0588; Category: Capacitor Ceramic; Values: 10uF 50V
C4 C9 C13 = 860020572003: WCAP-ATG5 Aluminum Electrolytic Capacitor, Radial, THT, D5 x H11mm, 10µF, 35V; Manufacturer: Wurth Elektronik; Capacitance Tolerance: +/-20%; Dissipation Factor: 12%; Endurance: 2000h; Leakage Current: 3.5uA; Ripple Current: 46mA; Technical Reference: ATDC110100M035DSPA3B000; Manufacturer Part Number: 860020572003; Category: Aluminum Electrolytic Capacitors; Match Code: WCAP-ATG5; ComponentLink1Description: Website Link; ComponentLink1URL: https://www.we-online.com/redexpert/article/860020572003?ad; ComponentLink2Description: Datasheet Link; ComponentLink2URL: https://www.we-online.com/redexpert/spec/860020572003?ad; Mount: Through Hole; Min Operating Temperature: -40°C; Max Operating Temperature: 105°C; Packaging: Ammo Pack; Height: 11mm; Diameter: 5mm; Capacitance: 10uF; Rated Voltage (DC): 35V
C11 C12 = CAPC0584: Capacitor Ceramic 4.7uF 50V 0805; Tolerance: %10; Value Rating: uF; Value: 4.7uF; Part Number: CAPC0584; Category: Capacitor Ceramic; Values: 4.7uF 50V
D1 = SMAJ15A-13-F: Diode; Manufacturer_Name: Diodes Incorporated; Datasheet Link: https://www.diodes.com/assets/Datasheets/ds19005.pdf; Height: 2.4mm; Manufacturer_Part_Number: SMAJ15A-13-F; Mouser Part Number: 621-SMAJ15A-13-F; Mouser Price/Stock: https://www.mouser.co.uk/ProductDetail/Diodes-Incorporated/SMAJ15A-13-F?qs=sxN%252BoM2fis%252B5%252BK6%2FciupkA%3D%3D; Arrow Part Number: SMAJ15A-13-F; Arrow Price/Stock: https://www.arrow.com/en/products/smaj15a-13-f/diodes-incorporated.html?utm_currency=USD&region=europe
D2 D3 = SMAJ18A: TVS Diode (Uni-directional); Manufacturer_Name: LITTELFUSE; Datasheet Link: https://www.littelfuse.com/~/media/electronics/datasheets/tvs_diodes/littelfuse_tvs_diode_smaj_datasheet.pdf.pdf; Height: 2.29mm; Manufacturer_Part_Number: SMAJ18A; Mouser Part Number: 576-SMAJ18A; Mouser Price/Stock: https://www.mouser.co.uk/ProductDetail/Littelfuse/SMAJ18A?qs=HR2RnyOI4E7wHW1lca9u5w%3D%3D; Arrow Part Number: SMAJ18A; Arrow Price/Stock: https://www.arrow.com/en/products/smaj18a/littelfuse?utm_currency=USD&region=nac
F1 = MF-R025: Fuse; Manufacturer_Name: Bourns; Datasheet Link: https://www.mouser.ph/datasheet/2/54/mf_r-777680.pdf; Height: 7.4mm; Manufacturer_Part_Number: MF-R025; Mouser Part Number: 652-MFR025; Mouser Price/Stock: https://www.mouser.co.uk/ProductDetail/Bourns/MF-R025?qs=NmEazmuVvbXTkonguszQtA%3D%3D; Arrow Part Number: MF-R025; Arrow Price/Stock: https://www.arrow.com/en/products/mf-r025/bourns?utm_currency=USD&region=nac
J1 = 694106301002: WR-DC Power Jack, THT, Right Angled, Center Pin 2mm, 5A, 30V (DC); Manufacturer: Wurth Elektronik; Plug Outer Diameter: 5.5mm; Manufacturer Part Number: 694106301002; Category: DC Power Jack Connector; Match Code: WR-DC; ComponentLink1Description: Website Link; ComponentLink1URL: https://www.we-online.com/redexpert/article/694106301002?ad; ComponentLink2Description: Datasheet Link; ComponentLink2URL: https://www.we-online.com/redexpert/spec/694106301002?ad; Mount: Through Hole; Min Operating Temperature: -40°C; Max Operating Temperature: 85°C; Packaging: Bag; Center Pin Diameter: 2mm; Orientation: Right Angled; Rated Current: 5A; Working Voltage: 30V (DC)
L1 = 744031100: WE-TPC SMT Tiny Power Inductor, size 3816, 10uH, 0.74A, 185mOhm; Manufacturer: Wurth Elektronik; Case/Size Code: 3816; Saturation Current: 0.56A; Self Resonant Frequency: 45MHz; Manufacturer Part Number: 744031100; Category: Power Inductors; Match Code: WE-TPC; ComponentLink1Description: Website Link; ComponentLink1URL: https://www.we-online.com/redexpert/article/744031100?ad; ComponentLink2Description: Datasheet Link; ComponentLink2URL: https://www.we-online.com/redexpert/spec/744031100?ad; Mount: Surface Mount; Min Operating Temperature: -40°C; Max Operating Temperature: 125°C; Packaging: Tape and Reel; Length: 3.8mm; Width: 3.8mm; Height: 1.65mm; DC Resistance: 185mOhm; Inductance: 10uH; Rated Current: 0.74A
PS1 = RD-1215D: Power Supply; Manufacturer_Name: RECOM Power; Datasheet Link: https://www.mouser.com/datasheet/2/468/RD-958126.pdf; Height: 10.7mm; Manufacturer_Part_Number: RD-1215D; Mouser Part Number: 919-RD-1215D; Mouser Price/Stock: https://www.mouser.co.uk/ProductDetail/RECOM-Power/RD-1215D?qs=XF8hdbuHJAUeGblPqJIAfA%3D%3D
Q1 = FDN340P: MOSFET (P-Channel); Manufacturer_Name: onsemi; Datasheet Link: https://www.onsemi.com/pub/Collateral/FDN340P-D.PDF; Height: 1.12mm; Manufacturer_Part_Number: FDN340P; Mouser Part Number: 512-FDN340P; Mouser Price/Stock: https://www.mouser.co.uk/ProductDetail/onsemi-Fairchild/FDN340P?qs=AMp2PTjoga9dhzFXRaqTZw%3D%3D; Arrow Part Number: FDN340P; Arrow Price/Stock: https://www.arrow.com/en/products/fdn340p/on-semiconductor?utm_currency=USD&region=nac
R1 = R0390: 100K 0805; Part Number: R0390; Tolerance: %5; Power: 1/10W; Value: 100K; Category: Resistor; Values: 100K
U1 = L78M05ACDT: Integrated Circuit; Manufacturer_Name: STMicroelectronics; Datasheet Link: https://componentsearchengine.com/Datasheets/2/L78M05ACDT.pdf; Height: 2.4mm; Manufacturer_Part_Number: L78M05ACDT; Mouser Part Number: 511-L78M05ACDT; Mouser Price/Stock: https://www.mouser.co.uk/ProductDetail/STMicroelectronics/L78M05ACDT?qs=y2nfjSRjEj0AoPOeCXWRuA%3D%3D
U2 U3 = LM1117IMP-3.3NOPB: 800-mA 15-V linear voltage regulator 4-SOT-223 -40 to 125; Manufacturer_Name: Texas Instruments; TYPE: TYPE; RefDes: RefDes; Copyright: Copyright (C) 2025 Ultra Librarian. All rights reserved.; Manufacturer_Part_Number: LM1117IMP-3.3/NOPB
U4 = ROE-0505S: Description; Manufacturer_Name: Recom Power; Copyright: Copyright (C) 2026 Ultra Librarian. All rights reserved.; Manufacturer_Part_Number: ROE-0505S; RefDes: RefDes; Type: Type
Z1 = MMSZ5240B: Zener Diode; Manufacturer_Name: onsemi; Datasheet Link: https://eu.mouser.com/datasheet/2/308/MMSZ5226B-1301377.pdf; Height: 1.28mm; Manufacturer_Part_Number: MMSZ5240B; Mouser Part Number: 512-MMSZ5240B; Mouser Price/Stock: https://www.mouser.co.uk/ProductDetail/onsemi-Fairchild/MMSZ5240B?qs=FITO%2F%2FQgYDlKkHnZqrmSpg%3D%3D; Arrow Part Number: MMSZ5240B; Arrow Price/Stock: https://www.arrow.com/en/products/mmsz5240b/on-semiconductor

## Sheet Voltage_Sens.SchDoc
size A4; SheetNumber: 4; SheetTotal: 6
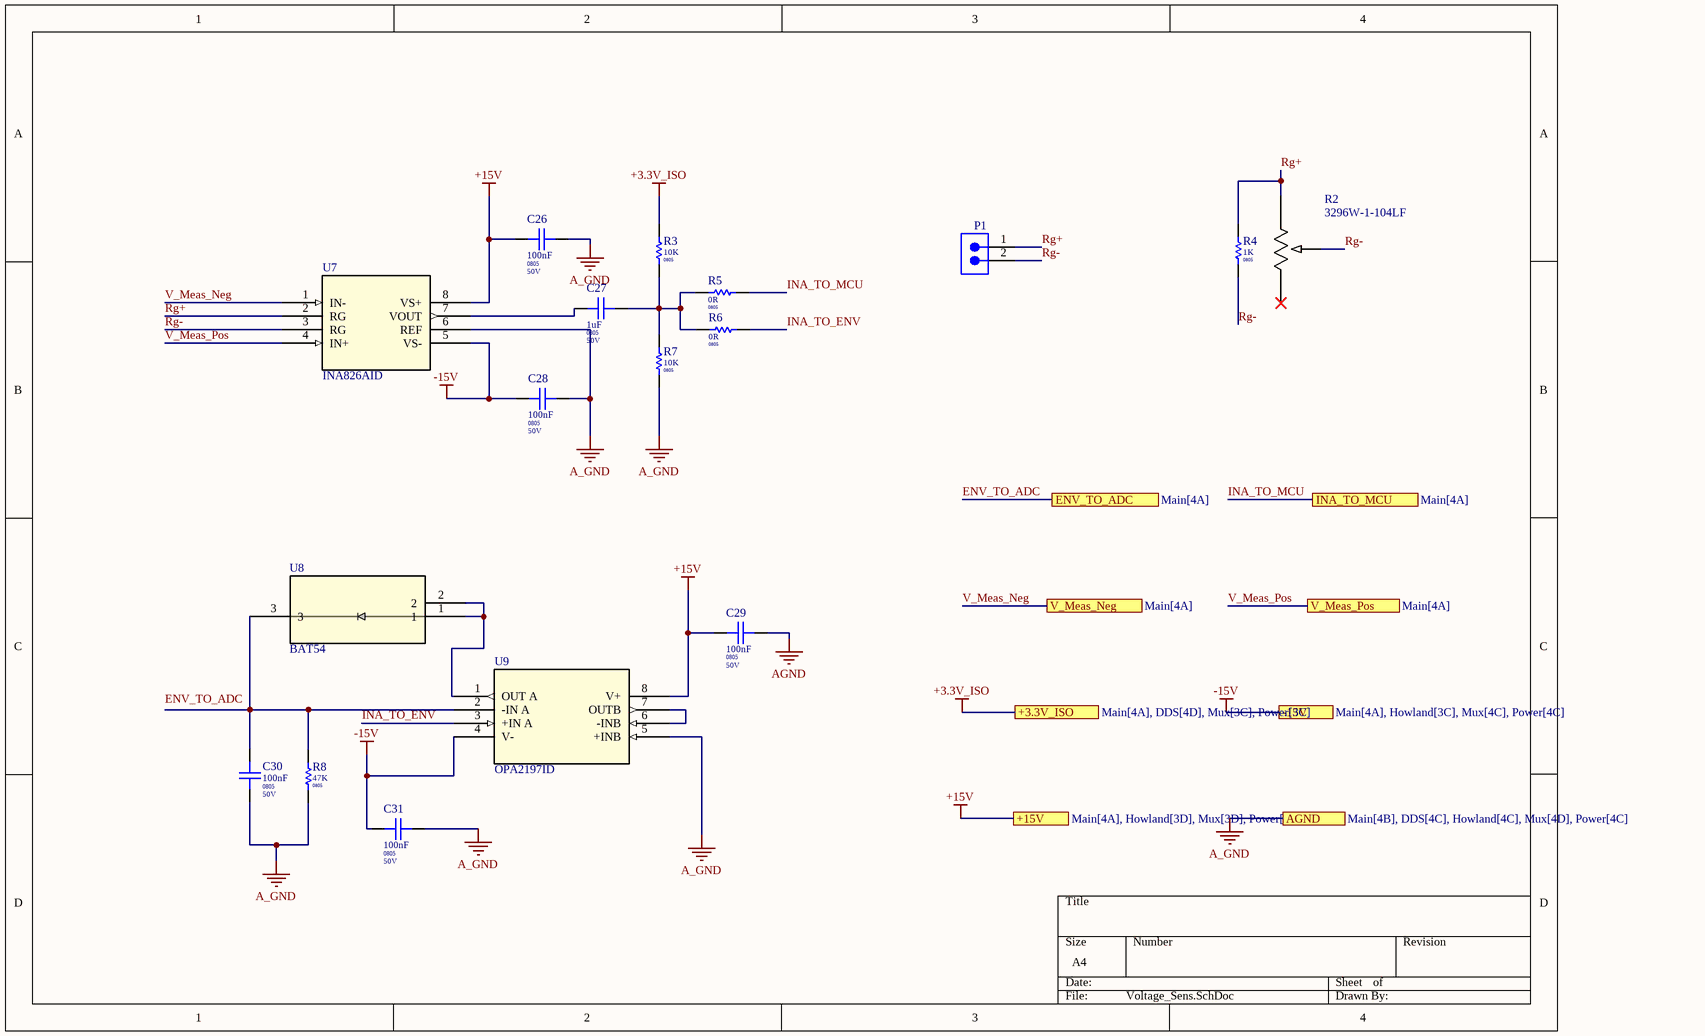
[diagram p4: Voltage_Sens.SchDoc]

### Parts
C26  Package / Case: 0805  Voltage: 50V  [CAPC 0805]  (hidden comment: 100nF)
C27  Package / Case: 0805  Voltage: 50V  [CAPC 0805]  (hidden comment: 1uF)
C28  Package / Case: 0805  Voltage: 50V  [CAPC 0805]  (hidden comment: 100nF)
C29  Package / Case: 0805  Voltage: 50V  [CAPC 0805]  (hidden comment: 100nF)
C30  Package / Case: 0805  Voltage: 50V  [CAPC 0805]  (hidden comment: 100nF)
C31  Package / Case: 0805  Voltage: 50V  [CAPC 0805]  (hidden comment: 100nF)
P1  61300211121  [61300211121]  (value not drawn)
R2  3296W-1-104LF  [POT_3296W]
R3  Package / Case: 0805  [RESC 0805]  (hidden comment: 10K)
R4  Package / Case: 0805  [RESC 0805]  (hidden comment: 1K)
R5  Package / Case: 0805  [RESC 0805]  (hidden comment: 0R)
R6  Package / Case: 0805  [RESC 0805]  (hidden comment: 0R)
R7  Package / Case: 0805  [RESC 0805]  (hidden comment: 10K)
R8  Package / Case: 0805  [RESC 0805]  (hidden comment: 47K)
U7  INA826AID  [D8-M]
U8  BAT54  [SOT-23_3L_ONS-M]
U9  OPA2197ID  [D8_TEX-M]

### Ports
+3.3V_ISO (see Main[4A], DDS[4D], Mux[3C], Power[3C]), +15V (see Main[4A], Howland[3D], Mux[3D], Power[4D]), -15V (see Main[4A], Howland[3C], Mux[4C], Power[4C]), AGND (see Main[4B], DDS[4C], Howland[4C], Mux[4D], Power[4C]), ENV_TO_ADC (see Main[4A]), INA_TO_MCU (see Main[4A]), V_Meas_Neg (see Main[4A]), V_Meas_Pos (see Main[4A])

### Nets
+3.3V_ISO: R3.2 ; port +3.3V_ISO
+15V: C26.2 C29.2 U7.8(VS+) U9.8(V+) ; port +15V
-15V: C28.2 C31.2 U7.5(VS-) U9.4(V-) ; port -15V
A_GND: C26.1 C28.1 C30.2 C31.1 R7.1 R8.1 U7.6(REF) U9.5(+INB) ; port AGND  [project net SIG]
AGND: C29.1
INA_TO_ENV: R6.2 U9.3(+IN_A)
INA_TO_MCU: R5.2 ; port INA_TO_MCU
Rg+: P1.1 R2.1 R4.2 U7.2(RG)
Rg-: P1.2 R2.2 R4.1 U7.3(RG)
V_Meas_Neg: U7.1(IN-) ; port V_Meas_Neg
V_Meas_Pos: U7.4(IN+) ; port V_Meas_Pos
NetC27_1: C27.1 U7.7(VOUT)
NetC27_2: C27.2 R3.1 R5.1 R6.1 R7.2
NetC30_1: C30.1 R8.2 U8.3 U9.2(-IN_A)
NetU8_1: U8.1 U8.2 U9.1(OUT_A)
NetU9_6: U9.6(-INB) U9.7(OUTB)

Not connected (* = marked no-connect by the designer): R2 3*

### Notes on the sheet
- Labels drawn without touching a wire or pin: ENV_TO_ADC

### Library data of the parts
C26 C28-C31 = CAPC0572: as C50 on sheet Main; Value: 100nF; Part Number: CAPC0572; Category: Capacitor Ceramic; Values: 100nF 50V
C27 = CAPC0580: as C39 on sheet Howland; Value: 1uF; Part Number: CAPC0580; Category: Capacitor Ceramic
P1 = 61300211121: WR-PHD Pin Header, THT, Vertical, pitch 2.54mm, 1 Row, 2P; Manufacturer: Wurth Elektronik; Contact Resistance: 20mOhm; Rated Current: 3A; Working Voltage: 250V; Withstanding Voltage: 500V; Manufacturer Part Number: 61300211121; Category: Board-to-Board Connectors; Match Code: WR-PHD; ComponentLink1Description: Website Link; ComponentLink1URL: https://www.we-online.com/redexpert/article/61300211121?ad; ComponentLink2Description: Datasheet Link; ComponentLink2URL: https://www.we-online.com/redexpert/spec/61300211121?ad; Mount: Through Hole; Min Operating Temperature: -40°C; Max Operating Temperature: 105°C; Packaging: Bag; Gender: Pin Header; Number of Pins: 2; Number of Rows: 1; Orientation: Vertical; Lead Pitch: 2.54mm
R2 = 3296W-1-104LF: as R21 on sheet Howland; Copyright: Copyright (C) 2025 Ultra Librarian. All rights reserved.; Manufacturer_Part_Number: 3296W-1-104LF
R3 R7 = R0366: as R23 on sheet Main; Value: 10K; Category: Resistor; Values: 10K
R4 = R0342: 1K 0805; Part Number: R0342; Tolerance: %5; Power: 1/10W; Value: 1K; Category: Resistor; Values: 1K
R5 R6 = R0294: 0R 0805; Part Number: R0294; Tolerance: %5; Power: 1/10W; Value: 0R; Category: Resistor; Values: 0R
R8 = R0382: 47K 0805; Part Number: R0382; Tolerance: %5; Power: 1/10W; Value: 47K; Category: Resistor; Values: 47K
U7 = INA826AID: Precision, 200-Î¼A Supply Current, 36-V Supply Instrumentation Amplifier 8-SOIC -40 to 125; Manufacturer_Name: Texas Instruments; Copyright: Copyright (C) 2025 Ultra Librarian. All rights reserved.; Manufacturer_Part_Number: INA826AID; RefDes: RefDes; Type: Type
U8 = BAT54: Description; Manufacturer_Name: onsemi; Copyright: Copyright (C) 2025 Ultra Librarian. All rights reserved.; Manufacturer_Part_Number: BAT54; RefDes: RefDes; Type: Type
U9 = OPA2197ID: as U11 on sheet Howland; Copyright: Copyright (C) 2025 Ultra Librarian. All rights reserved.; Manufacturer_Part_Number: OPA2197ID; RefDes: RefDes; Type: Type

## Sheet Mux.SchDoc
size A4; SheetNumber: 3; SheetTotal: 6
Used 4 times, as channels Mux_1, Mux_2, Mux_, Mux_4. Parts and nets are listed once, with the designators drawn on the sheet.
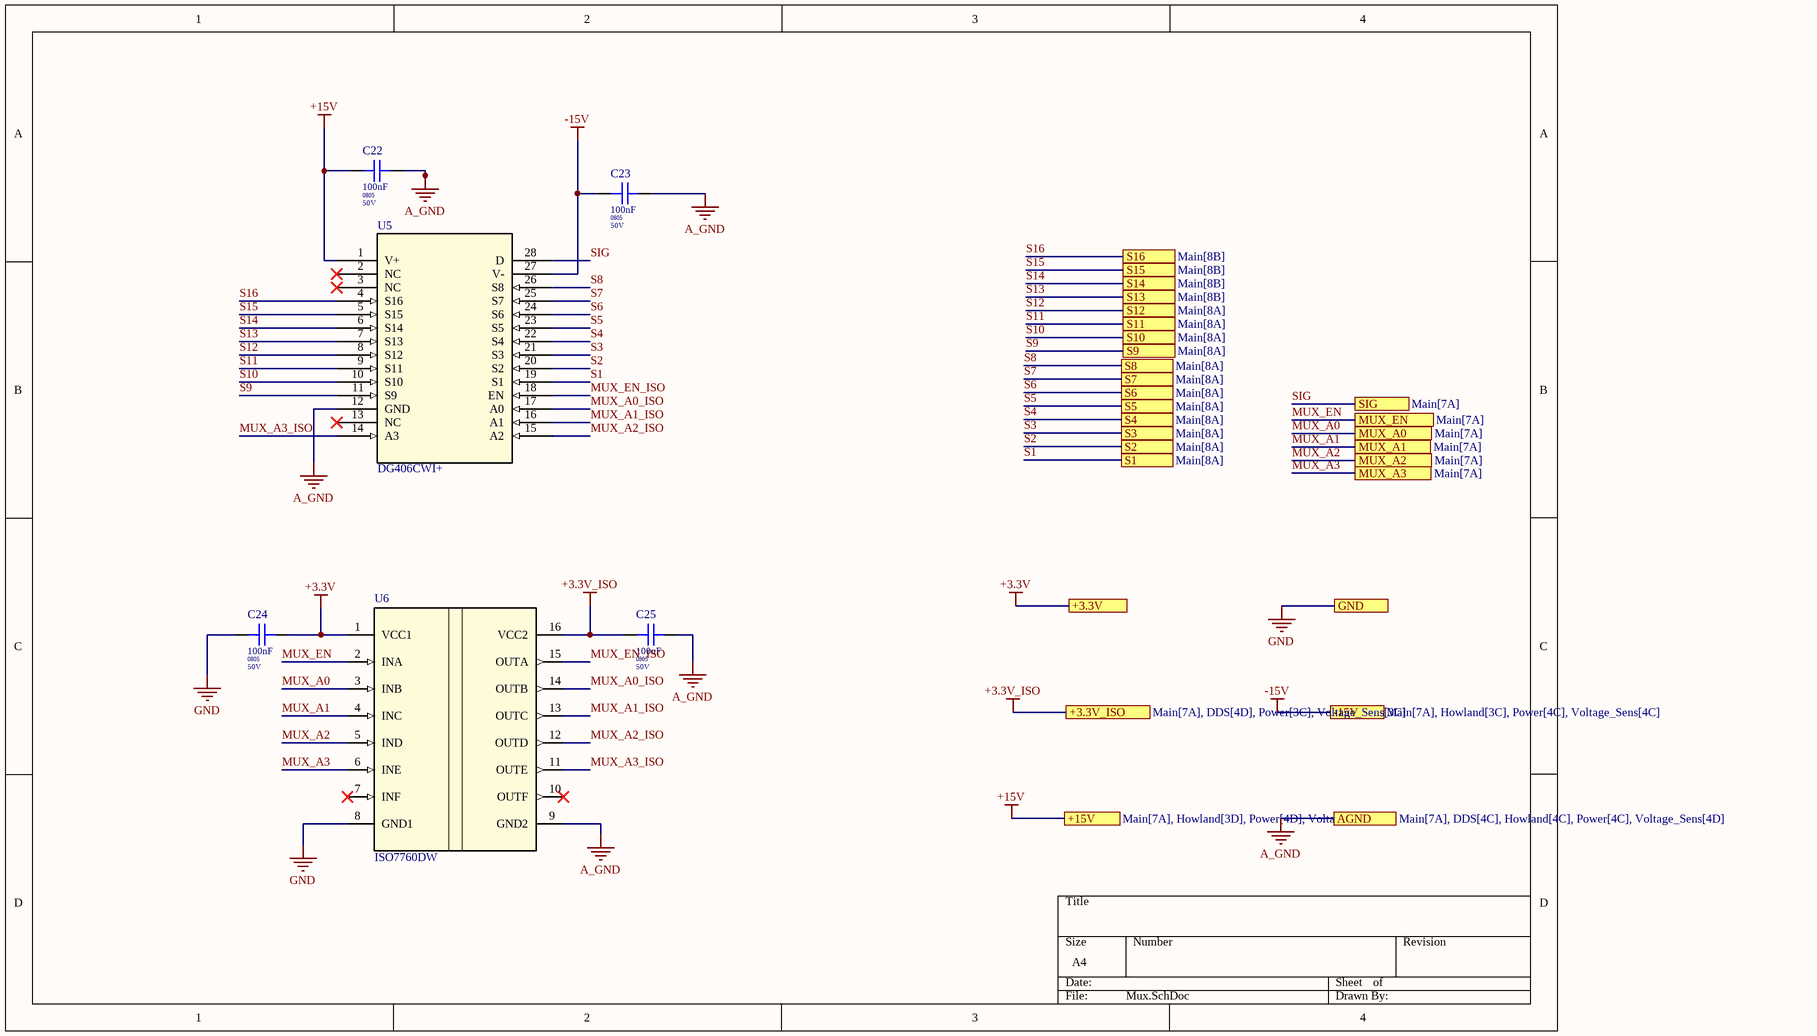
[diagram p5: Mux.SchDoc]

### Parts
C22  Package / Case: 0805  Voltage: 50V  [CAPC 0805]  (hidden comment: 100nF)
C23  Package / Case: 0805  Voltage: 50V  [CAPC 0805]  (hidden comment: 100nF)
C24  Package / Case: 0805  Voltage: 50V  [CAPC 0805]  (hidden comment: 100nF)
C25  Package / Case: 0805  Voltage: 50V  [CAPC 0805]  (hidden comment: 100nF)
U5  DG406CWI+  [21-0042_W28+6_MXM]
U6  ISO7760DW  [DW0016B_M]

### Ports
+3.3V, +3.3V_ISO (see Main[7A], DDS[4D], Power[3C], Voltage_Sens[3C]), +15V (see Main[7A], Howland[3D], Power[4D], Voltage_Sens[3D]), -15V (see Main[7A], Howland[3C], Power[4C], Voltage_Sens[4C]), AGND (see Main[7A], DDS[4C], Howland[4C], Power[4C], Voltage_Sens[4D]), GND, MUX_A0 (see Main[7A]), MUX_A1 (see Main[7A]), MUX_A2 (see Main[7A]), MUX_A3 (see Main[7A]), MUX_EN (see Main[7A]), S1 (see Main[8A]), S2 (see Main[8A]), S3 (see Main[8A]), S4 (see Main[8A]), S5 (see Main[8A]), S6 (see Main[8A]), S7 (see Main[8A]), S8 (see Main[8A]), S9 (see Main[8A]), S10 (see Main[8A]), S11 (see Main[8A]), S12 (see Main[8A]), S13 (see Main[8B]), S14 (see Main[8B]), S15 (see Main[8B]), S16 (see Main[8B]), SIG (see Main[7A])

### Nets
+3.3V: C24.1 U6.1(VCC1) ; port +3.3V
+3.3V_ISO: C25.2 U6.16(VCC2) ; port +3.3V_ISO
+15V: C22.2 U5.1(V+) ; port +15V
-15V: C23.2 U5.27(V-) ; port -15V
A_GND: C22.1 C23.1 C25.1 U5.12(GND) U6.9(GND2) ; port AGND
GND: C24.2 U6.8(GND1) ; port GND
MUX_A0: U6.3(INB) ; port MUX_A0
MUX_A0_ISO: U5.17(A0) U6.14(OUTB)
MUX_A1: U6.4(INC) ; port MUX_A1
MUX_A1_ISO: U5.16(A1) U6.13(OUTC)
MUX_A2: U6.5(IND) ; port MUX_A2
MUX_A2_ISO: U5.15(A2) U6.12(OUTD)
MUX_A3: U6.6(INE) ; port MUX_A3
MUX_A3_ISO: U5.14(A3) U6.11(OUTE)
MUX_EN: U6.2(INA) ; port MUX_EN
MUX_EN_ISO: U5.18(EN) U6.15(OUTA)
S1: U5.19(S1) ; port S1
S2: U5.20(S2) ; port S2
S3: U5.21(S3) ; port S3
S4: U5.22(S4) ; port S4
S5: U5.23(S5) ; port S5
S6: U5.24(S6) ; port S6
S7: U5.25(S7) ; port S7
S8: U5.26(S8) ; port S8
S9: U5.11(S9) ; port S9
S10: U5.10(S10) ; port S10
S11: U5.9(S11) ; port S11
S12: U5.8(S12) ; port S12
S13: U5.7(S13) ; port S13
S14: U5.6(S14) ; port S14
S15: U5.5(S15) ; port S15
S16: U5.4(S16) ; port S16
SIG: U5.28(D) ; port SIG

Not connected (* = marked no-connect by the designer): U5 2(NC)* 3(NC)* 13(NC)*; U6 7(INF)* 10(OUTF)*

### Channels
Mux_1: designators end in _Mux_1; ports +3.3V=+3.3V +3.3V_ISO=+3.3V_ISO +15V=+15V -15V=-15V AGND=SIG GND=GND MUX_A0=MUX_A0_HP MUX_A1=MUX_A1_HP MUX_A2=MUX_A2_HP MUX_A3=MUX_A3_HP MUX_EN=MUX_EN_HP S1=S1 S2=S2 S3=S3 S4=S4 S5=S5 S6=S6 S7=S7 S8=S8 S9=S9 S10=S10 S11=S11 S12=S12 S13=S13 S14=S14 S15=S15 S16=S16 SIG=SIG_HP
Mux_2: designators end in _Mux_2; ports +3.3V=+3.3V +3.3V_ISO=+3.3V_ISO +15V=+15V -15V=-15V AGND=SIG GND=GND MUX_A0=MUX_A0_HN MUX_A1=MUX_A1_HN MUX_A2=MUX_A2_HN MUX_A3=MUX_A3_HN MUX_EN=MUX_EN_HN S1=S1 S2=S2 S3=S3 S4=S4 S5=S5 S6=S6 S7=S7 S8=S8 S9=S9 S10=S10 S11=S11 S12=S12 S13=S13 S14=S14 S15=S15 S16=S16 SIG=SIG
Mux_: designators end in _Mux_; ports +3.3V=+3.3V +3.3V_ISO=+3.3V_ISO +15V=+15V -15V=-15V AGND=SIG GND=GND MUX_A0=MUX_A0_VP MUX_A1=MUX_A1_VP MUX_A2=MUX_A2_VP MUX_A3=MUX_A3_VP MUX_EN=MUX_EN_VP S1=S1 S2=S2 S3=S3 S4=S4 S5=S5 S6=S6 S7=S7 S8=S8 S9=S9 S10=S10 S11=S11 S12=S12 S13=S13 S14=S14 S15=S15 S16=S16 SIG=V_Meas_Pos
Mux_4: designators end in _Mux_4; ports +3.3V=+3.3V +3.3V_ISO=+3.3V_ISO +15V=+15V -15V=-15V AGND=SIG GND=GND MUX_A0=MUX_A0_VN MUX_A1=MUX_A1_VN MUX_A2=MUX_A2_VN MUX_A3=MUX_A3_VN MUX_EN=MUX_EN_VN S1=S1 S2=S2 S3=S3 S4=S4 S5=S5 S6=S6 S7=S7 S8=S8 S9=S9 S10=S10 S11=S11 S12=S12 S13=S13 S14=S14 S15=S15 S16=S16 SIG=V_Meas_Neg

### Library data of the parts
C22-C25 = CAPC0572: as C50 on sheet Main; Value: 100nF; Part Number: CAPC0572; Category: Capacitor Ceramic; Values: 100nF 50V
U5 = DG406CWI+: Improved, 16-Channel/Dual 8-Channel, CMOS Analog Multiplexers; Manufacturer_Name: Analog Devices Inc; Copyright: Copyright (C) 2026 Ultra Librarian. All rights reserved.; Manufacturer_Part_Number: DG406CWI+; RefDes: RefDes; Type: Type
U6 = ISO7760DW: Robust EMC, six-channel, 6/0, reinforced digital isolator 16-SOIC -55 to 125; Manufacturer_Name: Texas Instruments; TYPE: TYPE; RefDes: RefDes; Copyright: Copyright (C) 2025 Ultra Librarian. All rights reserved.; Manufacturer_Part_Number: ISO7760DW

## Nets that join several sheets
+3.3V: Main (7 pins), Power (C7.2 C8.2 U2.2 U2.4)
+3.3V_ISO: Main (C54.1 U14.10 U14.16), DDS (9 pins), Power (C15.2 C16.2 U3.2 U3.4), Voltage_Sens (R3.2), Mux_1 (C25_Mux_1.2 U6_Mux_1.16), Mux_2 (C25_Mux_2.2 U6_Mux_2.16), Mux_ (C25_Mux_.2 U6_Mux_.16), Mux_4 (C25_Mux_4.2 U6_Mux_4.16)
+5V: Main (7 pins), Power (8 pins)
+5V_ISO: Main (C58.1 U15.1), Power (5 pins)
+15V: Howland (C41.2 C48.2 U11.8 U12.8), Power (C9.1 C10.2 D2.1 PS1.6), Voltage_Sens (C26.2 C29.2 U7.8 U9.8), Mux_1 (C22_Mux_1.2 U5_Mux_1.1), Mux_2 (C22_Mux_2.2 U5_Mux_2.1), Mux_ (C22_Mux_.2 U5_Mux_.1), Mux_4 (C22_Mux_4.2 U5_Mux_4.1)
-15V: Howland (C40.2 C46.2 U11.4 U12.4), Power (C13.2 C17.1 D3.2 PS1.4), Voltage_Sens (C28.2 C31.2 U7.5 U9.4), Mux_1 (C23_Mux_1.2 U5_Mux_1.27), Mux_2 (C23_Mux_2.2 U5_Mux_2.27), Mux_ (C23_Mux_.2 U5_Mux_.27), Mux_4 (C23_Mux_4.2 U5_Mux_4.27)
GND: Main (14 pins), Power (20 pins)
SIG: Main (U14.9 U14.15), DDS (18 pins), Howland (10 pins), Power (14 pins), Voltage_Sens (8 pins), Mux_1 (5 pins), Mux_2 (6 pins), Mux_ (5 pins), Mux_4 (5 pins)
COMP: Main (U14.11), DDS (U10.16)
FSYNC: Main (U14.12), DDS (U10.15)
INA_TO_MCU: Main (C56.2 R23.1 U13.34 U16.6), Voltage_Sens (R5.2)
IOUT: DDS (R9.2 U10.19), Howland (C44.1)
IOUTB: DDS (R10.2 U10.20), Howland (C43.1)
MUX_A0_HN: Main (U13.1), Mux_2 (U6_Mux_2.3)
MUX_A0_HP: Main (U13.27), Mux_1 (U6_Mux_1.3)
MUX_A0_VN: Main (U13.31), Mux_4 (U6_Mux_4.3)
MUX_A0_VP: Main (U13.11), Mux_ (U6_Mux_.3)
MUX_A1_HN: Main (U13.2), Mux_2 (U6_Mux_2.4)
MUX_A1_HP: Main (U13.26), Mux_1 (U6_Mux_1.4)
MUX_A1_VN: Main (U13.5), Mux_4 (U6_Mux_4.4)
MUX_A1_VP: Main (U13.12), Mux_ (U6_Mux_.4)
MUX_A2_HN: Main (U13.3), Mux_2 (U6_Mux_2.5)
MUX_A2_HP: Main (U13.25), Mux_1 (U6_Mux_1.5)
MUX_A2_VN: Main (U13.6), Mux_4 (U6_Mux_4.5)
MUX_A2_VP: Main (U13.13), Mux_ (U6_Mux_.5)
MUX_A3_HN: Main (U13.4), Mux_2 (U6_Mux_2.6)
MUX_A3_HP: Main (U13.24), Mux_1 (U6_Mux_1.6)
MUX_A3_VN: Main (U13.7), Mux_4 (U6_Mux_4.6)
MUX_A3_VP: Main (U13.14), Mux_ (U6_Mux_.6)
MUX_EN_HN: Main (U13.37), Mux_2 (U6_Mux_2.2)
MUX_EN_HP: Main (U13.10), Mux_1 (U6_Mux_1.2)
MUX_EN_VN: Main (U13.17), Mux_4 (U6_Mux_4.2)
MUX_EN_VP: Main (U13.16), Mux_ (U6_Mux_.2)
S1: Main (J2.1), Mux_1 (U5_Mux_1.19), Mux_2 (U5_Mux_2.19), Mux_ (U5_Mux_.19), Mux_4 (U5_Mux_4.19)
S2: Main (J2.2), Mux_1 (U5_Mux_1.20), Mux_2 (U5_Mux_2.20), Mux_ (U5_Mux_.20), Mux_4 (U5_Mux_4.20)
S3: Main (J2.3), Mux_1 (U5_Mux_1.21), Mux_2 (U5_Mux_2.21), Mux_ (U5_Mux_.21), Mux_4 (U5_Mux_4.21)
S4: Main (J2.4), Mux_1 (U5_Mux_1.22), Mux_2 (U5_Mux_2.22), Mux_ (U5_Mux_.22), Mux_4 (U5_Mux_4.22)
S5: Main (J2.5), Mux_1 (U5_Mux_1.23), Mux_2 (U5_Mux_2.23), Mux_ (U5_Mux_.23), Mux_4 (U5_Mux_4.23)
S6: Main (J2.6), Mux_1 (U5_Mux_1.24), Mux_2 (U5_Mux_2.24), Mux_ (U5_Mux_.24), Mux_4 (U5_Mux_4.24)
S7: Main (J2.7), Mux_1 (U5_Mux_1.25), Mux_2 (U5_Mux_2.25), Mux_ (U5_Mux_.25), Mux_4 (U5_Mux_4.25)
S8: Main (J2.8), Mux_1 (U5_Mux_1.26), Mux_2 (U5_Mux_2.26), Mux_ (U5_Mux_.26), Mux_4 (U5_Mux_4.26)
S9: Main (J2.9), Mux_1 (U5_Mux_1.11), Mux_2 (U5_Mux_2.11), Mux_ (U5_Mux_.11), Mux_4 (U5_Mux_4.11)
S10: Main (J2.10), Mux_1 (U5_Mux_1.10), Mux_2 (U5_Mux_2.10), Mux_ (U5_Mux_.10), Mux_4 (U5_Mux_4.10)
S11: Main (J2.11), Mux_1 (U5_Mux_1.9), Mux_2 (U5_Mux_2.9), Mux_ (U5_Mux_.9), Mux_4 (U5_Mux_4.9)
S12: Main (J2.12), Mux_1 (U5_Mux_1.8), Mux_2 (U5_Mux_2.8), Mux_ (U5_Mux_.8), Mux_4 (U5_Mux_4.8)
S13: Main (J2.13), Mux_1 (U5_Mux_1.7), Mux_2 (U5_Mux_2.7), Mux_ (U5_Mux_.7), Mux_4 (U5_Mux_4.7)
S14: Main (J2.14), Mux_1 (U5_Mux_1.6), Mux_2 (U5_Mux_2.6), Mux_ (U5_Mux_.6), Mux_4 (U5_Mux_4.6)
S15: Main (J2.15), Mux_1 (U5_Mux_1.5), Mux_2 (U5_Mux_2.5), Mux_ (U5_Mux_.5), Mux_4 (U5_Mux_4.5)
S16: Main (J2.16), Mux_1 (U5_Mux_1.4), Mux_2 (U5_Mux_2.4), Mux_ (U5_Mux_.4), Mux_4 (U5_Mux_4.4)
SCLK: Main (U14.13), DDS (U10.14)
SDATA: Main (U14.14), DDS (U10.13)
SIG_HP: Howland (R18.1 R20.1), Mux_1 (U5_Mux_1.28)
V_Meas_Neg: Voltage_Sens (U7.1), Mux_4 (U5_Mux_4.28)
V_Meas_Pos: Voltage_Sens (U7.4), Mux_ (U5_Mux_.28)